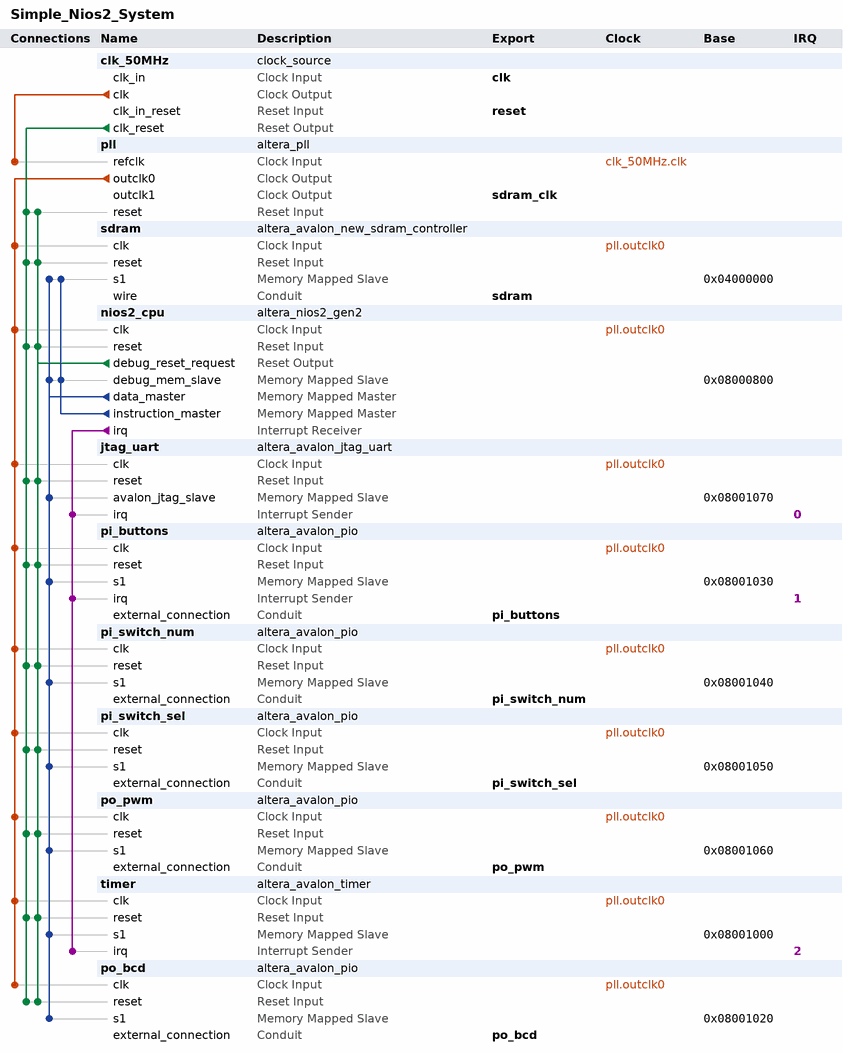
[diagram p0: system contents]
# Platform Designer (Qsys) system Simple_Nios2_System, Cyclone V 5CSXFC6D6F31C6
# Parameters at their usual value, and those the tool derives, are not listed.
package require -exact qsys 18.1
create_system Simple_Nios2_System
set_project_property DEVICE_FAMILY {Cyclone V}
set_project_property DEVICE 5CSXFC6D6F31C6

add_instance clk_50MHz clock_source 18.1
set_instance_parameter_value clk_50MHz clockFrequency 50000000

add_instance pll altera_pll 18.1
set_instance_parameter_value pll gui_device_speed_grade 1
set_instance_parameter_value pll gui_number_of_clocks 2
set_instance_parameter_value pll gui_operation_mode direct
set_instance_parameter_value pll gui_output_clock_frequency0 50.0
set_instance_parameter_value pll gui_output_clock_frequency1 50.0
set_instance_parameter_value pll gui_phase_shift0 3000
set_instance_parameter_value pll gui_pll_mode {Integer-N PLL}
set_instance_parameter_value pll gui_reference_clock_frequency 50.0
set_instance_parameter_value pll gui_use_locked false

add_instance sdram altera_avalon_new_sdram_controller 18.1
set_instance_parameter_value sdram TAC 5.4
set_instance_parameter_value sdram TRCD 15.0
set_instance_parameter_value sdram TRP 15.0
set_instance_parameter_value sdram casLatency 3
set_instance_parameter_value sdram columnWidth 10
set_instance_parameter_value sdram dataWidth 16
set_instance_parameter_value sdram generateSimulationModel false
set_instance_parameter_value sdram model single_Micron_MT48LC4M32B2_7_chip
set_instance_parameter_value sdram numberOfBanks 4
set_instance_parameter_value sdram numberOfChipSelects 1
set_instance_parameter_value sdram powerUpDelay 100.0
set_instance_parameter_value sdram refreshPeriod 7.8125
set_instance_parameter_value sdram rowWidth 13

add_instance nios2_cpu altera_nios2_gen2 18.1
set_instance_parameter_value nios2_cpu dcache_size 2048
set_instance_parameter_value nios2_cpu exceptionSlave sdram.s1
set_instance_parameter_value nios2_cpu icache_size 4096
set_instance_parameter_value nios2_cpu impl Tiny
set_instance_parameter_value nios2_cpu resetSlave sdram.s1

add_instance jtag_uart altera_avalon_jtag_uart 18.1
set_instance_parameter_value jtag_uart simInteractiveOptions NO_INTERACTIVE_WINDOWS

add_instance pi_buttons altera_avalon_pio 18.1
set_instance_parameter_value pi_buttons bitClearingEdgeCapReg true
set_instance_parameter_value pi_buttons captureEdge true
set_instance_parameter_value pi_buttons direction Input
set_instance_parameter_value pi_buttons generateIRQ true
set_instance_parameter_value pi_buttons irqType EDGE
set_instance_parameter_value pi_buttons width 4

add_instance pi_switch_num altera_avalon_pio 18.1
set_instance_parameter_value pi_switch_num direction Input
set_instance_parameter_value pi_switch_num width 8

add_instance pi_switch_sel altera_avalon_pio 18.1
set_instance_parameter_value pi_switch_sel direction Input
set_instance_parameter_value pi_switch_sel width 1

add_instance po_pwm altera_avalon_pio 18.1
set_instance_parameter_value po_pwm direction Output
set_instance_parameter_value po_pwm resetValue 255
set_instance_parameter_value po_pwm width 8

add_instance timer altera_avalon_timer 18.1
set_instance_parameter_value timer period 1
set_instance_parameter_value timer periodUnits MSEC
set_instance_parameter_value timer snapshot false

add_instance po_bcd altera_avalon_pio 18.1
set_instance_parameter_value po_bcd direction Output
set_instance_parameter_value po_bcd width 12

# connections
add_connection clk_50MHz.clk pll.refclk clock
add_connection pll.outclk0 jtag_uart.clk clock
add_connection pll.outclk0 nios2_cpu.clk clock
add_connection pll.outclk0 pi_buttons.clk clock
add_connection pll.outclk0 pi_switch_num.clk clock
add_connection pll.outclk0 pi_switch_sel.clk clock
add_connection pll.outclk0 po_bcd.clk clock
add_connection pll.outclk0 po_pwm.clk clock
add_connection pll.outclk0 sdram.clk clock
add_connection pll.outclk0 timer.clk clock
add_connection clk_50MHz.clk_reset jtag_uart.reset reset
add_connection clk_50MHz.clk_reset nios2_cpu.reset reset
add_connection clk_50MHz.clk_reset pi_buttons.reset reset
add_connection clk_50MHz.clk_reset pi_switch_num.reset reset
add_connection clk_50MHz.clk_reset pi_switch_sel.reset reset
add_connection clk_50MHz.clk_reset pll.reset reset
add_connection clk_50MHz.clk_reset po_bcd.reset reset
add_connection clk_50MHz.clk_reset po_pwm.reset reset
add_connection clk_50MHz.clk_reset sdram.reset reset
add_connection clk_50MHz.clk_reset timer.reset reset
add_connection nios2_cpu.debug_reset_request jtag_uart.reset reset
add_connection nios2_cpu.debug_reset_request nios2_cpu.reset reset
add_connection nios2_cpu.debug_reset_request pi_buttons.reset reset
add_connection nios2_cpu.debug_reset_request pi_switch_num.reset reset
add_connection nios2_cpu.debug_reset_request pi_switch_sel.reset reset
add_connection nios2_cpu.debug_reset_request pll.reset reset
add_connection nios2_cpu.debug_reset_request po_bcd.reset reset
add_connection nios2_cpu.debug_reset_request po_pwm.reset reset
add_connection nios2_cpu.debug_reset_request sdram.reset reset
add_connection nios2_cpu.debug_reset_request timer.reset reset
add_connection nios2_cpu.data_master jtag_uart.avalon_jtag_slave avalon
set_connection_parameter_value nios2_cpu.data_master/jtag_uart.avalon_jtag_slave baseAddress 0x08001070
add_connection nios2_cpu.data_master nios2_cpu.debug_mem_slave avalon
set_connection_parameter_value nios2_cpu.data_master/nios2_cpu.debug_mem_slave baseAddress 0x08000800
add_connection nios2_cpu.data_master pi_buttons.s1 avalon
set_connection_parameter_value nios2_cpu.data_master/pi_buttons.s1 baseAddress 0x08001030
add_connection nios2_cpu.data_master pi_switch_num.s1 avalon
set_connection_parameter_value nios2_cpu.data_master/pi_switch_num.s1 baseAddress 0x08001040
add_connection nios2_cpu.data_master pi_switch_sel.s1 avalon
set_connection_parameter_value nios2_cpu.data_master/pi_switch_sel.s1 baseAddress 0x08001050
add_connection nios2_cpu.data_master po_bcd.s1 avalon
set_connection_parameter_value nios2_cpu.data_master/po_bcd.s1 baseAddress 0x08001020
add_connection nios2_cpu.data_master po_pwm.s1 avalon
set_connection_parameter_value nios2_cpu.data_master/po_pwm.s1 baseAddress 0x08001060
add_connection nios2_cpu.data_master sdram.s1 avalon
set_connection_parameter_value nios2_cpu.data_master/sdram.s1 baseAddress 0x04000000
add_connection nios2_cpu.data_master timer.s1 avalon
set_connection_parameter_value nios2_cpu.data_master/timer.s1 baseAddress 0x08001000
add_connection nios2_cpu.instruction_master nios2_cpu.debug_mem_slave avalon
set_connection_parameter_value nios2_cpu.instruction_master/nios2_cpu.debug_mem_slave baseAddress 0x08000800
add_connection nios2_cpu.instruction_master sdram.s1 avalon
set_connection_parameter_value nios2_cpu.instruction_master/sdram.s1 baseAddress 0x04000000
add_connection nios2_cpu.irq jtag_uart.irq interrupt
set_connection_parameter_value nios2_cpu.irq/jtag_uart.irq irqNumber 0
add_connection nios2_cpu.irq pi_buttons.irq interrupt
set_connection_parameter_value nios2_cpu.irq/pi_buttons.irq irqNumber 1
add_connection nios2_cpu.irq timer.irq interrupt
set_connection_parameter_value nios2_cpu.irq/timer.irq irqNumber 2

# exported interfaces
add_interface clk clock sink
set_interface_property clk EXPORT_OF clk_50MHz.clk_in
add_interface pi_buttons conduit end
set_interface_property pi_buttons EXPORT_OF pi_buttons.external_connection
add_interface pi_switch_num conduit end
set_interface_property pi_switch_num EXPORT_OF pi_switch_num.external_connection
add_interface pi_switch_sel conduit end
set_interface_property pi_switch_sel EXPORT_OF pi_switch_sel.external_connection
add_interface po_bcd conduit end
set_interface_property po_bcd EXPORT_OF po_bcd.external_connection
add_interface po_pwm conduit end
set_interface_property po_pwm EXPORT_OF po_pwm.external_connection
add_interface reset reset sink
set_interface_property reset EXPORT_OF clk_50MHz.clk_in_reset
add_interface sdram conduit end
set_interface_property sdram EXPORT_OF sdram.wire
add_interface sdram_clk clock source
set_interface_property sdram_clk EXPORT_OF pll.outclk1

set_interconnect_requirement {$system} qsys_mm.clockCrossingAdapter HANDSHAKE
set_interconnect_requirement {$system} qsys_mm.enableEccProtection FALSE
set_interconnect_requirement {$system} qsys_mm.insertDefaultSlave FALSE
set_interconnect_requirement {$system} qsys_mm.maxAdditionalLatency 1

save_system Simple_Nios2_System.qsys
